# Altium project UWB_Beacon.PrjPcb
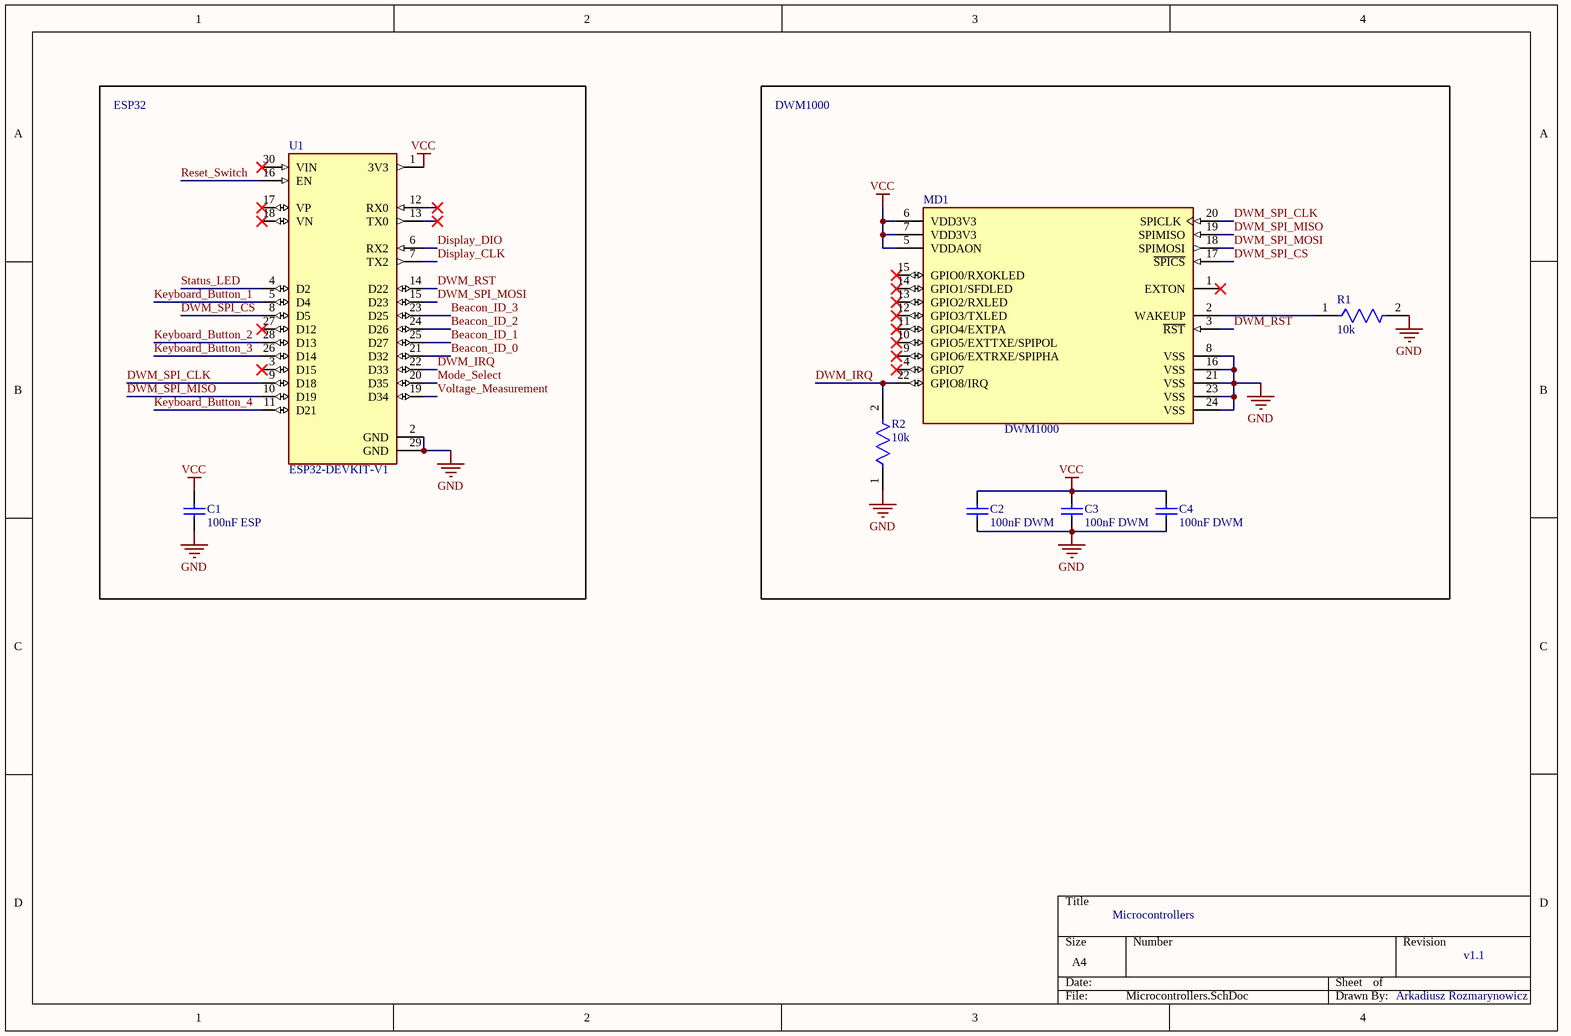
[diagram p0: Microcontrollers.SchDoc]
4 sheets, 63 parts. Net scope: global (net labels, ports and power ports of the same name join across sheets).
Board file: UWB_Beacon_PCB.PcbDoc
Sheets:
  Microcontrollers.SchDoc
  Power.SchDoc
  Connectors.SchDoc
  Interface.SchDoc

## Sheet Microcontrollers.SchDoc
size A4; SheetNumber: 1; SheetTotal: 4

### Parts
C1  100nF ESP  [CAPC2013X145X48NL20T23]
C2  100nF DWM  [CAPC2013X145X48NL20T23]
C3  100nF DWM  [CAPC2013X145X48NL20T23]
C4  100nF DWM  [CAPC2013X145X48NL20T23]
MD1  DWM1000  [FP-DWM1000-MFG]
R1  10k  [FP-CRGCQ0805-IPC_C]
R2  10k  [FP-CRGCQ0805-IPC_C]
U1  ESP32-DEVKIT-V1  [MODULE_ESP32_DEVKIT_V1]

### Blocks framed on the sheet
ESP32: C1 U1
DWM1000: C2-C4 MD1 R1 R2

### Nets
GND: C1.1 C2.1 C3.1 C4.1 MD1.8(VSS) MD1.16(VSS) MD1.21(VSS) MD1.23(VSS) MD1.24(VSS) R1.2 R2.1 U1.2(GND) U1.29(GND)
VCC: C1.2 C2.2 C3.2 C4.2 MD1.5(VDDAON) MD1.6(VDD3V3) MD1.7(VDD3V3) U1.1(3V3)
Beacon_ID_0: U1.21(D32)
Beacon_ID_1: U1.25(D27)
Beacon_ID_2: U1.24(D26)
Beacon_ID_3: U1.23(D25)
Display_CLK: U1.7(TX2)
Display_DIO: U1.6(RX2)
DWM_IRQ: MD1.22(GPIO8/IRQ) R2.2 U1.22(D33)
DWM_RST: MD1.3(~{RST}) U1.14(D22)
DWM_SPI_CLK: MD1.20(SPICLK) U1.9(D18)
DWM_SPI_CS: MD1.17(~{SPICS}) U1.8(D5)
DWM_SPI_MISO: MD1.19(SPIMISO) U1.10(D19)
DWM_SPI_MOSI: MD1.18(SPIMOSI) U1.15(D23)
Keyboard_Button_1: U1.5(D4)
Keyboard_Button_2: U1.28(D13)
Keyboard_Button_3: U1.26(D14)
Keyboard_Button_4: U1.11(D21)
Mode_Select: U1.20(D35)
Reset_Switch: U1.16(EN)
Status_LED: U1.4(D2)
Voltage_Measurement: U1.19(D34)
NetMD1_2: MD1.2(WAKEUP) R1.1

Not connected (* = marked no-connect by the designer): MD1 1(EXTON)* 4(GPIO7)* 9(GPIO6/EXTRXE/SPIPHA)* 10(GPIO5/EXTTXE/SPIPOL)* 11(GPIO4/EXTPA)* 12(GPIO3/TXLED)* 13(GPIO2/RXLED)* 14(GPIO1/SFDLED)* 15(GPIO0/RXOKLED)*; U1 3(D15)* 12(RX0)* 13(TX0)* 17(VP)* 18(VN)* 27(D12)* 30(VIN)*

### Notes on the sheet
- Microcontrollers
- v1.1
- Arkadiusz Rozmarynowicz

### Library data of the parts
C1-C4 = CMP-2007-01705-1: Part Number: VJ0805Y104KXAMR; Manufacturer: Vitramon
MD1 = CMP-231853-000001-1: RX TXRX MODULE 802.15.4 CHIP SMD
R1 R2 = CMP-03211-009742-1: CRGCQ0805 10KΩ 0.125W ±100ppm/°C 5% 150V; Manufacturer Part Number: CRGCQ0805J100K; Manufacturer: TE Connectivity; Tolerance: 0.05; Temperature Range High: +155°C; Resistance: 10k; Automotive Grade: Grade 1142; RoHS: TRUE; Package: CRGCQ0805; Octopart: https://octopart.com/crgcq0805j100k-te+connectivity-91018199; Device Class L1: Passive Components; Lead Free: Yes; Temperature: -55°C to +155°C; Category: Res; ComponentLink2Description: Datasheet; Power Rating: 0.125W; Ambient Temperature Range High: +70°C; Composition: Thick Film; Temperature Range Low: -55°C; Voltage Rating: 150V; Device Class L3: Chip SMD Resistors; Height: 0.65mm; Series: CRGCQ; Temperature Coefficient: ±100ppm/°C; Automotive: Yes; Device Class L2: Resistors; Ipc Land Pattern Name: RESC200125X55; ComponentLink2URL: https://www.te.com/commerce/DocumentDelivery/DDEController?Action=showdoc&DocId=Data+Sheet%7F1773204-3%7F1%7Fpdf%7FEnglish%7FENG_DS_1773204-3_1.pdf%7F4-2176341-1151; Value: 10k
U1 = ESP32-DEVKIT-V1: Dual core, Wi-Fi: 2.4 GHz up to 150 Mbits/s,BLE (Bluetooth Low Energy) and legacy Bluetooth, 32 bits, Up to 240 MHz; MF: Do it; SnapEDA_Link: https://www.snapeda.com/parts/ESP32-DEVKIT-V1/Do+it/view-part/?ref=snap; Package: None; Value: *; MP: ESP32-DEVKIT-V1; Check_prices: https://www.snapeda.com/parts/ESP32-DEVKIT-V1/Do+it/view-part/?ref=eda

## Sheet Power.SchDoc
size A4; SheetNumber: 2; SheetTotal: 4
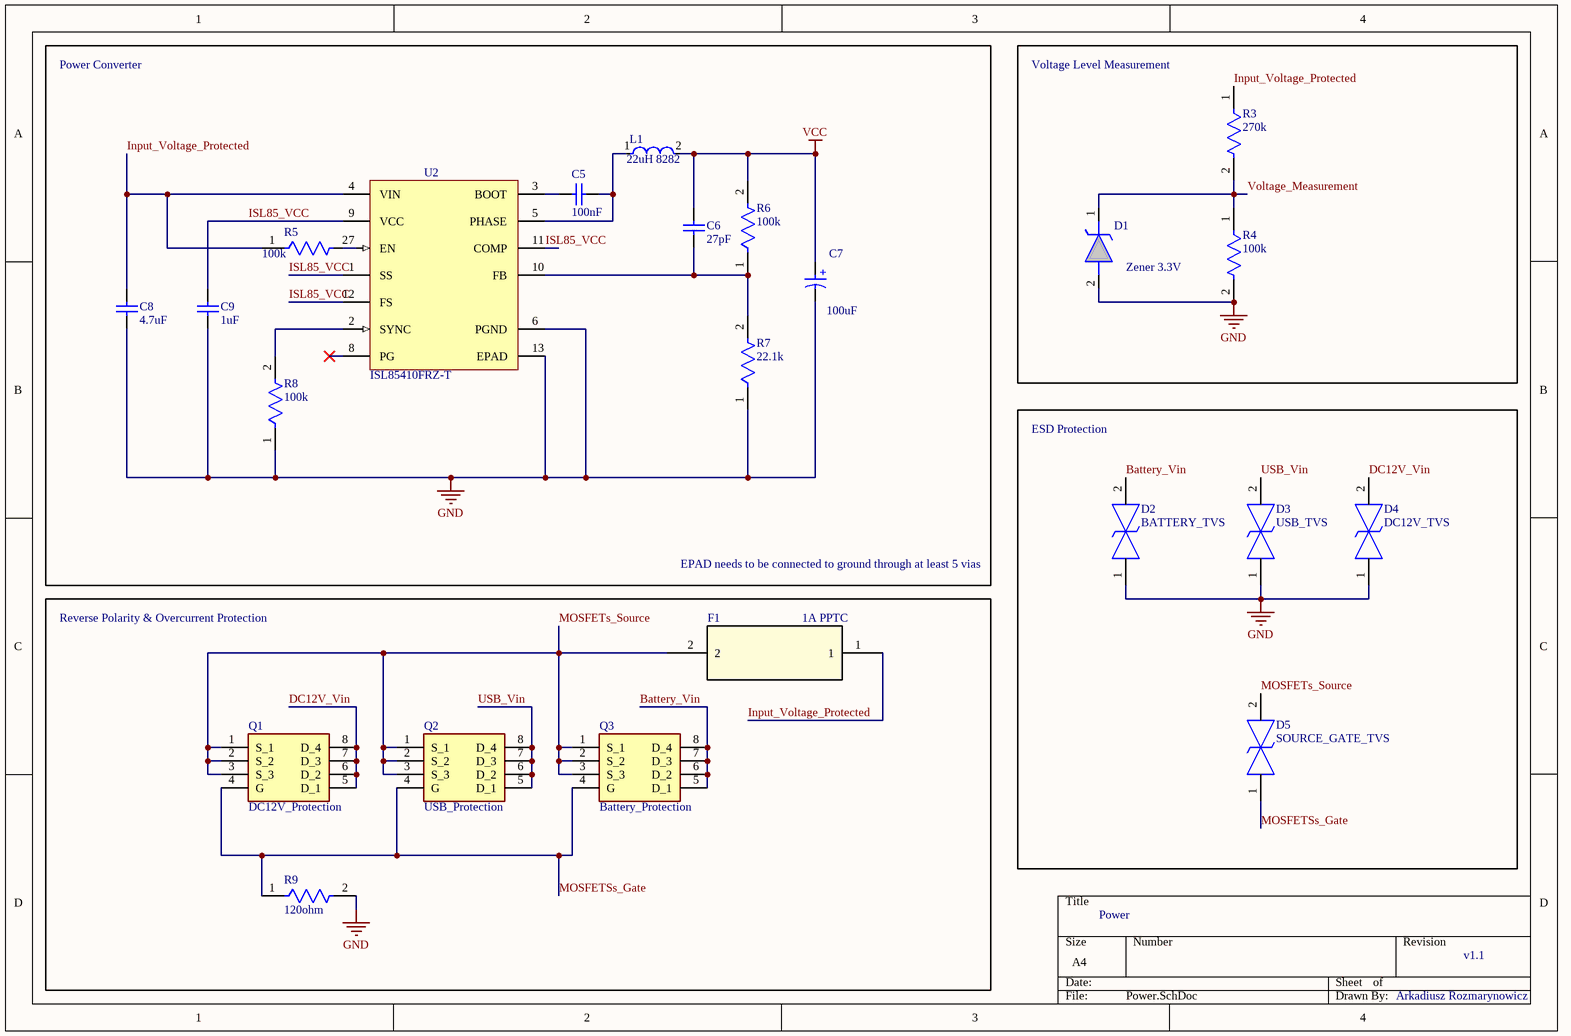
[diagram p1: Power.SchDoc]

### Parts
C5  100nF  [CAPC2013X145X48NL20T23]
C6  27pF  [CAPC2013X145X48NL20T23]
C7  100uF  [WCAP-ASLI_D6.3H7.7]
C8  4.7uF  [CAPC2013X145X48NL20T23]
C9  1uF  [CAPC2013X145X48NL20T23]
D1  Zener 3.3V  [ZMM33B]
D2  BATTERY_TVS  [DIONM5127X250N]
D3  USB_TVS  [DIONM5127X250N]
D4  DC12V_TVS  [DIONM5127X250N]
D5  SOURCE_GATE_TVS  [DIONM5127X250N]
F1  1A PPTC  [CHIP_ 0603L_1P8X1_LTF]
L1  22uH 8282  [FP-IHLP-3232DZ-FP_2_413x5-MFG]
Q1  DC12V_Protection  [SOIC127P600X170-8N]
Q2  USB_Protection  [SOIC127P600X170-8N]
Q3  Battery_Protection  [SOIC127P600X170-8N]
R3  270k  [FP-CRGCQ0805-IPC_C]
R4  100k  [FP-CRGCQ0805-IPC_C]
R5  100k  [FP-CRGCQ0805-IPC_C]
R6  100k  [FP-CRGCQ0805-IPC_C]
R7  22.1k  [FP-CRGCQ0805-IPC_C]
R8  100k  [FP-CRGCQ0805-IPC_C]
R9  120ohm  [FP-CRGCQ0805-IPC_C]
U2  ISL85410FRZ-T  [L12_4x3_MFG]

### Blocks framed on the sheet
Voltage Level Measurement: D1 R3 R4
ESD Protection: D2-D5
Reverse Polarity & Overcurrent Protection: F1 Q1-Q3 R9

### Nets
GND: C7.2(N) C8.1 C9.1 D1.2(A) D2.1 D3.1 D4.1 R4.2 R7.1 R8.1 R9.2 U2.6(PGND) U2.13(EPAD)
VCC: C6.2 C7.1(P) L1.2 R6.2
Battery_Vin: D2.2 Q3.5(D_1) Q3.6(D_2) Q3.7(D_3) Q3.8(D_4)
DC12V_Vin: D4.2 Q1.5(D_1) Q1.6(D_2) Q1.7(D_3) Q1.8(D_4)
Input_Voltage_Protected: C8.2 F1.1 R3.1 R5.1 U2.4(VIN)
ISL85_VCC: C9.2 U2.1(SS) U2.9(VCC) U2.11(COMP) U2.12(FS)
MOSFETs_Source: D5.2 F1.2 Q1.1(S_1) Q1.2(S_2) Q1.3(S_3) Q2.1(S_1) Q2.2(S_2) Q2.3(S_3) Q3.1(S_1) Q3.2(S_2) Q3.3(S_3)
MOSFETSs_Gate: D5.1 Q1.4(G) Q2.4(G) Q3.4(G) R9.1
USB_Vin: D3.2 Q2.5(D_1) Q2.6(D_2) Q2.7(D_3) Q2.8(D_4)
Voltage_Measurement: D1.1(K) R3.2 R4.1
NetC5_1: C5.1 L1.1 U2.5(PHASE)
NetC5_2: C5.2 U2.3(BOOT)
NetC6_1: C6.1 R6.1 R7.2 U2.10(FB)
NetR5_2: R5.2 U2.7(EN)
NetR8_2: R8.2 U2.2(SYNC)

Not connected (* = marked no-connect by the designer): U2 8(PG)*

### Notes on the sheet
- Power Converter
- EPAD needs to be connected to ground through at least 5 vias
- Power
- v1.1
- Arkadiusz Rozmarynowicz
- (in symbol CMP-03913-54202496-2) +

### Library data of the parts
C5 C6 C8 C9 = CMP-2007-01705-1: as C1 on sheet Microcontrollers
C7 = CMP-03913-54202496-2: Cap Aluminum Lytic 100uF 35V 20% (6.3 X 7.7mm) SMD 300mA 2000h 105C T/R; Capacitance: 100µF; Impedance: 380mΩ; Insulation Resistance: 1MΩ; ESR (Equivalent Series Resistance): 321.392mΩ; Dissipation Factor: 14%; Leakage Current: 35µA; Life (Hours): 2000hours; Min Operating Temperature: -55°C; Height: 7.7mm; Tolerance: 20%; Ripple Current (AC): 300mA; Length: 7.7mm; Width: 6.6mm; Voltage Rating: 35V; REACH SVHC: Unknown; Ripple Current: 300mA; Diameter: 6.3mm; Max Operating Temperature: 105°C; RoHS: Compliant; Voltage Rating (DC): 35V; Packaging: Cut Tape; Case/Package: Radial
D1 = ZMM33B: SMD Planra Zener Diode; Manufacturer_Name: Diotec; Geometry.Height: 1.45mm; Manufacturer_Part_Number: ZMM33B; Mouser Part Number: 637-ZMM33B; Mouser Price/Stock: https://www.mouser.co.uk/ProductDetail/Diotec-Semiconductor/ZMM33B?qs=OlC7AqGiEDlS5hTI7j6ASg%3D%3D; Arrow Part Number: ZMM33B; Arrow Price/Stock: https://www.arrow.com/en/products/zmm33b/diotec-semiconductor-ag?utm_currency=USD&region=nac; Datasheet Link: *
D2-D5 = SMAJ12CA-HP6AT_13: 19.9V Clamp 30.2A Ipp Tvs Diode Surface Mount DO-214AC (SMA); Manufacturer_Name: YAGEO; Manufacturer_Part_Number: SMAJ12CA-HP6AT/13; Geometry.Height: 2.5mm; Mouser Part Number: *; Mouser Price/Stock: *; Arrow Part Number: *; Arrow Price/Stock: *; Datasheet Link: https://www.yageo.com/upload/media/product/productsearch/datasheet/cpc/tvs/SMAJ-HP6AT_1.pdf
F1 = 0603L100SLYR: PPTC; Manufacturer_Name: Littelfuse Inc; Copyright: Copyright (C) 2025 Ultra Librarian. All rights reserved.; Manufacturer_Part_Number: 0603L100SLYR; RefDes: RefDes; Type: Type
L1 = CMP-02424-000385-1: Commercial Inductors, High Temperature (155 °C) Series 22uH 3.7A 110.21mΩ 20%; Max DC Current: 3.8A; DC Resistance (DCR): 110.21mR; Self Resonant Frequency: 9MHz; Test Frequency: 100kHz; Shielding: Shielded; Length: 0.322inch; Inductance: 22uH; Package Quantity: 500; Military Standard: Not; Min Operating Temperature: -55°C; Lead Free: Lead Free; Packaging: Tape and Reel; Current Rating: 3.7A; Depth: 8.26mm; Height: 4mm; Max Operating Temperature: 155°C; Width: 0.322inch; Tolerance: 20%; Case/Package: 3232; Saturation Current: 3.8A; Height - Seated (Max): 0.158inch; Mount: Surface Mount; Termination: SMD/SMT
Q1-Q3 = DMP3056LSS-13: MOSFET P Channel 30V 7.1A 2.1V @ 250uA 45m @ 6A,10V SOP-8_150mil RoHS; Manufacturer_Name: Diodes Incorporated; Geometry.Height: 1.7mm; Manufacturer_Part_Number: DMP3056LSS-13; Mouser Part Number: 621-DMP3056LSS-13; Mouser Price/Stock: https://www.mouser.co.uk/ProductDetail/Diodes-Incorporated/DMP3056LSS-13?qs=oUsD4qhOtFyEnPLZKitYRA%3D%3D; Arrow Part Number: DMP3056LSS-13; Arrow Price/Stock: https://www.arrow.com/en/products/dmp3056lss-13/diodes-incorporated?region=asia; Datasheet Link: https://www.diodes.com//assets/Datasheets/ds31421.pdf
R3 R4 R9 = CMP-03211-009742-1: CRGCQ0805 10KΩ 0.125W ±100ppm/°C 5% 150V; Manufacturer Part Number: CRGCQ0805J100K; Manufacturer: TE Connectivity; Resistance: 100ohm; Tolerance: 0.05; Value: 100ohm; Temperature Range High: +155°C; Automotive Grade: Grade 1142; RoHS: TRUE; Package: CRGCQ0805; Octopart: https://octopart.com/crgcq0805j100k-te+connectivity-91018199; Device Class L1: Passive Components; Lead Free: Yes; Temperature: -55°C to +155°C; Category: Res; ComponentLink2Description: Datasheet; Power Rating: 0.125W; Ambient Temperature Range High: +70°C; Composition: Thick Film; Temperature Range Low: -55°C; Voltage Rating: 150V; Device Class L3: Chip SMD Resistors; Height: 0.65mm; Series: CRGCQ; Temperature Coefficient: ±100ppm/°C; Automotive: Yes; Device Class L2: Resistors; Ipc Land Pattern Name: RESC200125X55; ComponentLink2URL: https://www.te.com/commerce/DocumentDelivery/DDEController?Action=showdoc&DocId=Data+Sheet%7F1773204-3%7F1%7Fpdf%7FEnglish%7FENG_DS_1773204-3_1.pdf%7F4-2176341-1151
R5-R8 = CMP-03211-009742-1: CRGCQ0805 100KΩ 0.125W ±100ppm/°C 5% 150V; Manufacturer Part Number: CRGCQ0805J100K; Manufacturer: TE Connectivity; Tolerance: 0.05; Temperature Range High: +155°C; Automotive Grade: Grade 1142; RoHS: TRUE; Package: CRGCQ0805; Octopart: https://octopart.com/crgcq0805j100k-te+connectivity-91018199; Device Class L1: Passive Components; Lead Free: Yes; Temperature: -55°C to +155°C; Category: Res; ComponentLink2Description: Datasheet; Power Rating: 0.125W; Ambient Temperature Range High: +70°C; Composition: Thick Film; Temperature Range Low: -55°C; Voltage Rating: 150V; Device Class L3: Chip SMD Resistors; Height: 0.65mm; Series: CRGCQ; Temperature Coefficient: ±100ppm/°C; Automotive: Yes; Device Class L2: Resistors; Ipc Land Pattern Name: RESC200125X55; ComponentLink2URL: https://www.te.com/commerce/DocumentDelivery/DDEController?Action=showdoc&DocId=Data+Sheet%7F1773204-3%7F1%7Fpdf%7FEnglish%7FENG_DS_1773204-3_1.pdf%7F4-2176341-1151
  R5 R6 R8: Resistance: 100KΩ; Value: 100KΩ
  R7: Resistance: 22.1k; Value: 22.1k
U2 = CMP-00572-88255842-3: Inverter RoHS Compliant Adjustable Positive Switching Regulator IC 125C 2MHz 1A 82.298666mg; Manufacturer Lifecycle Status: ACTIVE; Efficiency: 94%; RAM Size: 12kB; Max Supply Voltage: 40V; Topology: Buck; Min Output Voltage: 600mV; Max Junction Temperature (Tj): 125°C; Min Supply Voltage: 3V; Pitch: 500µm; Operating Supply Current: 4µA; Sync/Async: Synchronous; Max Output Voltage: 34V; Number of Outputs: 1; Synchronous Rectifier: Yes; Operating Supply Voltage: 36V; Quiescent Current: 80µA; HelpURL: https://octopart.com/cad-content/api/get-model-datasheet/15189/88255842; ComponentLink1URL: http://www.renesas.com; Switching Frequency: 2MHz; ComponentLink3URL: https://www.renesas.com/en/document/psc/l124x3-12-lead-dual-flat-no-lead-plastic-package?r=568491; Max Operating Temperature: 125°C; Export Control Classification Number (ECCN) Code: EAR99; Lead Free: Lead Free; ComponentLink2Description: Datasheet URL; Length: 4mm; Min Operating Temperature: -40°C; ComponentLink2URL: https://octopart.com/cad-content/api/get-model-datasheet/15189/88255842; ComponentLink1Description: Manufacturer's Website; Width: 3mm; Output Type: Adjustable; Max Output Current: 1A; Packaging: Tape & Reel; Case/Package: DFN; Mount: Surface Mount; Number of Pins: 12; Weight: 82.298666mg; Min Input Voltage: 3V; ComponentLink3Description: Manufacturer's Package Drawing; Max Input Voltage: 40V; Logic Function: Inverter; RoHS: Compliant; Output Current: 1A; Output Configuration: Positive; Lifecycle Status: Production; Height: 900µm; Output Voltage: 34V; Radiation Hardening: No

## Sheet Connectors.SchDoc
size A4; SheetNumber: 3; SheetTotal: 4
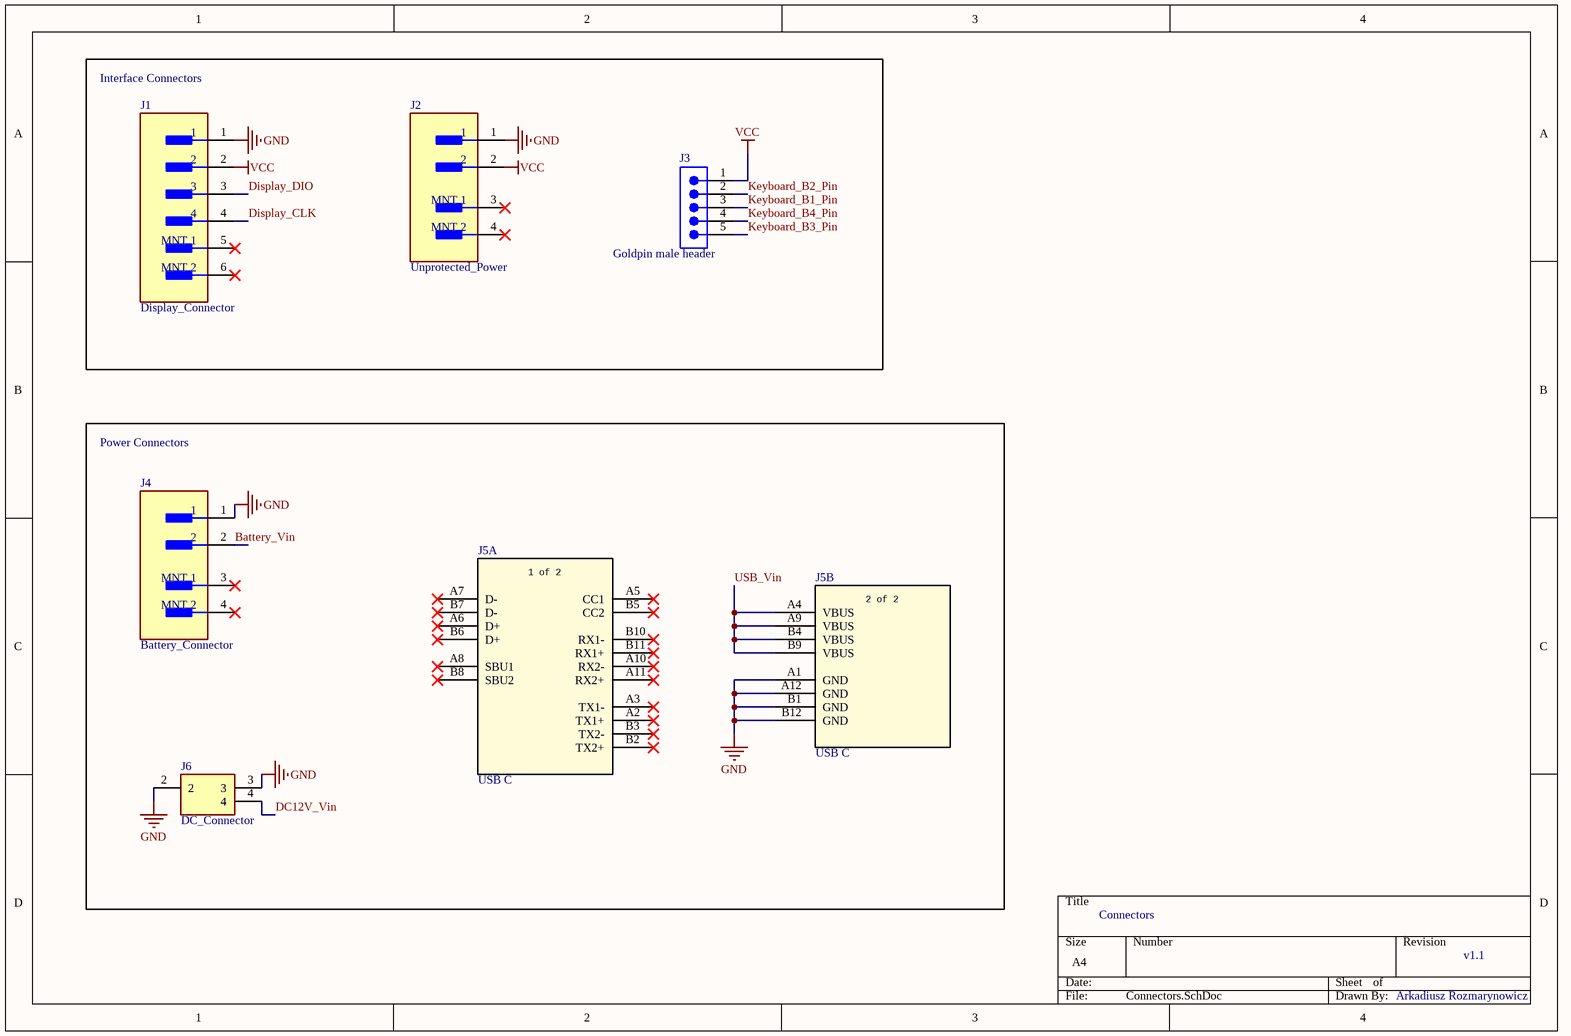
[diagram p2: Connectors.SchDoc]

### Parts
J1  Display_Connector  [FP-BM04B-GHS-TBT_LF_SN-MFG]
J2  Unprotected_Power  [FP-SM02B-GHS-TB_LF_SN-MFG]
J3  Goldpin male header  [SMTC-MTLW-105-05-X-S-190]
J4  Battery_Connector  [FP-SM02B-GHS-TB_LF_SN-MFG]
J5  USB C  [CONN_1054500101_MOL]  (parts A,B of 2)
J6  DC_Connector  [PCGK21]

### Blocks framed on the sheet
Interface Connectors: J1-J3
Power Connectors: J4-J6

### Nets
GND: J1.1 J2.1 J4.1 J5.A1(GND) J5.A12(GND) J5.B1(GND) J5.B12(GND) J6.2 J6.3
VCC: J1.2 J2.2 J3.1
Battery_Vin: J4.2
DC12V_Vin: J6.4
Display_CLK: J1.4
Display_DIO: J1.3
Keyboard_B1_Pin: J3.3
Keyboard_B2_Pin: J3.2
Keyboard_B3_Pin: J3.5
Keyboard_B4_Pin: J3.4
USB_Vin: J5.A4(VBUS) J5.A9(VBUS) J5.B4(VBUS) J5.B9(VBUS)

Not connected (* = marked no-connect by the designer): J1 5(MNT_1)* 6(MNT_2)*; J2 3(MNT_1)* 4(MNT_2)*; J4 3(MNT_1)* 4(MNT_2)*; J5 A2(TX1+)* A3(TX1-)* A5(CC1)* A6(D+)* A7(D-)* A8(SBU1)* A10(RX2-)* A11(RX2+)* B2(TX2+)* B3(TX2-)* B5(CC2)* B6(D+)* B7(D-)* B8(SBU2)* B10(RX1-)* B11(RX1+)*

### Notes on the sheet
- Connectors
- v1.1
- Arkadiusz Rozmarynowicz
- (in symbol 1054500101, part A) 1 of 2
- (in symbol 1054500101, part B) 2 of 2

### Library data of the parts
J1 = CMP-17439-000062-2: CONN HEADER SMD 4POS 1.25MM; Number of Positions: 4; Wire/Cable Gauge: 26AWG; Current Rating: 1A; Voltage Rating (AC): 50V; Gender: Male; Orientation: Straight; Max Operating Temperature: 85°C; Pitch: 1.25mm; Contact Plating: Tin; Number of Rows: 4; Series: GH; Min Operating Temperature: -25°C; REACH SVHC: No SVHC; Packaging: Cut Tape; Lead Free: Lead Free; Voltage Rating: 50V; Contact Material: Bronze; Number of Contacts: 4; Termination: Crimp; Case/Package: SMD/SMT; Housing Color: Natural; Housing Material: Nylon
J2 J4 = CMP-2000-07076-2: CONN HEADER SMD R/A 2POS 1.25MM; Voltage Rating: 50V; Number of Positions: 2; Pitch: 0.049inch; Current Rating: 1A; Connector Type: Outer Shroud Contact; Number of Rows: 1; Contact Material: Bronze; Termination: Solder; Color: Natural; Package Quantity: 2500; Mount: Surface Mount; Housing Color: Natural; Number of Contacts: 2; Packaging: Tape and Reel; Lead Free: Lead Free; Housing Material: Nylon; Orientation: Right Angle; Contact Type: Male Pin; Contact Plating: Tin; Series: GH; Fastening Type: Latch
J3 = CMP-1024-00077-1: Low Profile .025" SQ Post Header, Through-hole, Vertical, -55 to 105 degC, 2.54 mm Pitch, 5-Pin, Male, RoHS; Manufacturer: Samtec; PartNumber: MTLW-105-05-T-S-190; Pitch: 2.54 mm; RoHS: True; Temperature Range: -55 to 105 degC; Orientation: Vertical; ComponentLink1Description: Manufacturer URL; DatasheetVersion: F-214; ComponentLink3URL: http://www.samtec.com/documents/webfiles/cpdf/MTLW-1XX-XX-XX-X-XXX-XX-XX-MKT1.pdf; ComponentLink2URL: http://www.samtec.com/documents/webfiles/pdf/MTLW_TH.PDF; Mounting Technology: Through-hole; ComponentLink1URL: http://www.samtec.com; ComponentLink2Description: Datasheet; ComponentLink3Description: Package Specification; PackageVersion: T, 6/1991; PackageReference: MTLW-105-05-X-S-190; PackageDescription: Low Profile Terminal Assembly
J5 = 1054500101: Universal Serial Bus (USB) Shielded I/O Receptacle, Type C, Right-Angle, Top Mount, Surface Mount, 0.80mm Solder Tabs, Gold (Au) Flash over 0.76Âµm Palladium Nickel Plating; Manufacturer_Name: Molex; Copyright: Copyright (C) 2026 Ultra Librarian. All rights reserved.; Manufacturer_Part_Number: 1054500101; RefDes: RefDes; Type: Type
J6 = PC-GK2.1: Socket; DC supply; male; 5.5/2.1mm; 5.5mm; 2.1mm; THT; angled 90; Manufacturer_Name: Ninigi; Geometry.Height: 11.2mm; Manufacturer_Part_Number: PC-GK2.1; Mouser Part Number: *; Mouser Price/Stock: *; Arrow Part Number: *; Arrow Price/Stock: *; Datasheet Link: https://www.tme.eu/Document/78afd4fb8a41e4211137cd818ea9e93d/PC-GK21.jpg

## Sheet Interface.SchDoc
size A4; SheetNumber: 4; SheetTotal: 4
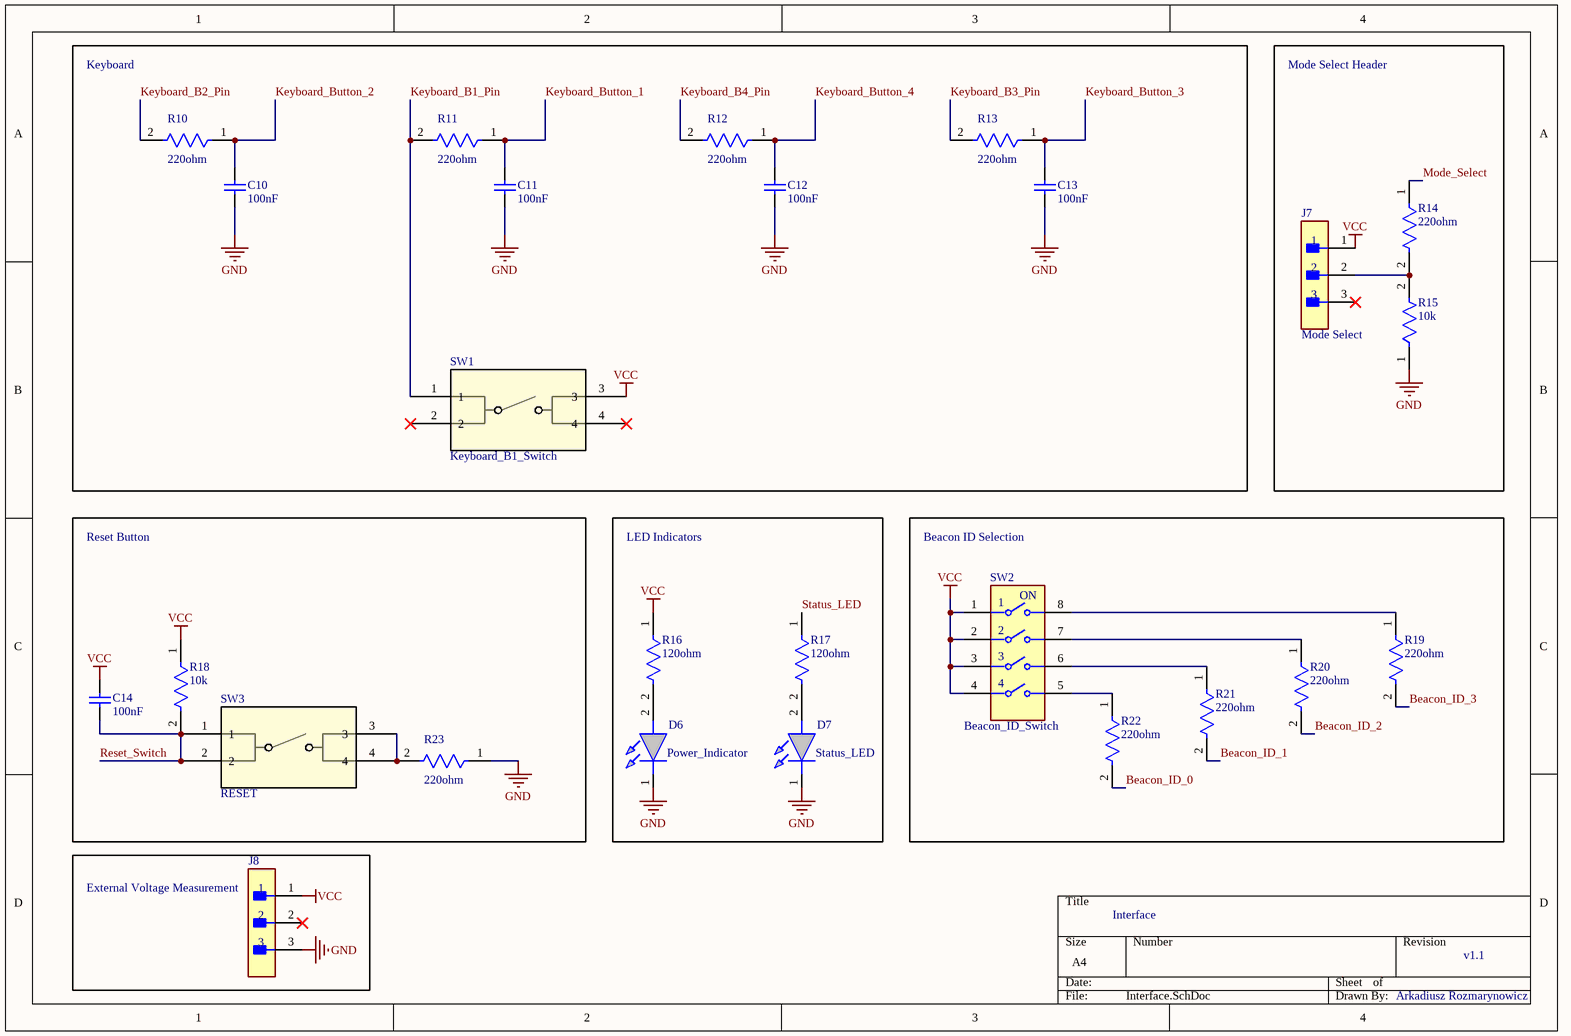
[diagram p3: Interface.SchDoc]

### Parts
C10  100nF  [CAPC2013X145X48NL20T23]
C11  100nF  [CAPC2013X145X48NL20T23]
C12  100nF  [CAPC2013X145X48NL20T23]
C13  100nF  [CAPC2013X145X48NL20T23]
C14  100nF  [CAPC2013X145X48NL20T23]
D6  Power_Indicator  [LEDC2012X40N]
D7  Status_LED  [LEDC2012X40N]
J7  Mode Select  [FP-TMM-103-03-T-S-MFG]
J8  External Voltage Measurement  [FP-TMM-103-03-T-S-MFG]
R10  220ohm  [FP-CRGCQ0805-IPC_C]
R11  220ohm  [FP-CRGCQ0805-IPC_C]
R12  220ohm  [FP-CRGCQ0805-IPC_C]
R13  220ohm  [FP-CRGCQ0805-IPC_C]
R14  220ohm  [FP-CRGCQ0805-IPC_C]
R15  10k  [FP-CRGCQ0805-IPC_C]
R16  120ohm  [FP-CRGCQ0805-IPC_C]
R17  120ohm  [FP-CRGCQ0805-IPC_C]
R18  10k  [FP-CRGCQ0805-IPC_C]
R19  220ohm  [FP-CRGCQ0805-IPC_C]
R20  220ohm  [FP-CRGCQ0805-IPC_C]
R21  220ohm  [FP-CRGCQ0805-IPC_C]
R22  220ohm  [FP-CRGCQ0805-IPC_C]
R23  220ohm  [FP-CRGCQ0805-IPC_C]
SW1  Keyboard_B1_Switch  [SW4_FSM-5P23_TEC]
SW2  Beacon_ID_Switch  [FP-A6S-4104-H-MFG]
SW3  RESET  [SW4_FSM-5P23_TEC]

### Blocks framed on the sheet
Keyboard: C10-C13 R10-R13 SW1
Mode Select Header: J7 R14 R15
LED Indicators: D6 D7 R16 R17
Beacon ID Selection: R19-R22 SW2

### Nets
GND: C10.1 C11.1 C12.1 C13.1 D6.1(K) D7.1(K) J8.3 R15.1 R23.1
VCC: C14.2 J7.1 J8.1 R16.1 R18.1 SW1.3 SW2.1 SW2.2 SW2.3 SW2.4
Beacon_ID_0: R22.2
Beacon_ID_1: R21.2
Beacon_ID_2: R20.2
Beacon_ID_3: R19.2
Keyboard_B1_Pin: R11.2 SW1.1
Keyboard_B2_Pin: R10.2
Keyboard_B3_Pin: R13.2
Keyboard_B4_Pin: R12.2
Keyboard_Button_1: C11.2 R11.1
Keyboard_Button_2: C10.2 R10.1
Keyboard_Button_3: C13.2 R13.1
Keyboard_Button_4: C12.2 R12.1
Mode_Select: R14.1
Reset_Switch: C14.1 R18.2 SW3.1 SW3.2
Status_LED: R17.1
NetD6_2: D6.2(A) R16.2
NetD7_2: D7.2(A) R17.2
NetJ7_2: J7.2 R14.2 R15.2
NetR19_1: R19.1 SW2.8
NetR20_1: R20.1 SW2.7
NetR21_1: R21.1 SW2.6
NetR22_1: R22.1 SW2.5
NetR23_2: R23.2 SW3.3 SW3.4

Not connected (* = marked no-connect by the designer): J7 3*; J8 2*; SW1 2* 4*

### Notes on the sheet
- Reset Button
- Interface
- v1.1
- Arkadiusz Rozmarynowicz
- (in symbol CMP-08827-000006-1) ON

### Library data of the parts
C10-C14 = CMP-2007-01705-1: as C1 on sheet Microcontrollers
D6 D7 = LS_R976: Red 0805 CHIPLED LS R976N-R102 Osram Opto LS R976, CHIPLED 0805 Series Red LED, 633 nm, 2012 (0805), Rectangle Lens SMD Package; Manufacturer_Name: ams OSRAM; Manufacturer_Part_Number: LS R976; Geometry.Height: 0.4mm; Mouser Part Number: 720-LSR976D5178; Mouser Price/Stock: https://www.mouser.co.uk/ProductDetail/OSRAM-Opto-Semiconductors/LS-R976?qs=OIr7YF%252B2cWVTfzKl425Fkw%3D%3D; Arrow Part Number: LS R976; Arrow Price/Stock: https://www.arrow.com/en/products/lsr976/osram-opto-semiconductors?region=europe; Datasheet Link: http://uk.rs-online.com/web/p/products/4974804
J7 J8 = CMP-02766-001695-1: CONN HEADER VERT 3POS 2MM; Gender: Male; Number of Positions: 3; Max Current Rating: 3.9A; Max Voltage Rating (AC): 500V; Packaging: Bulk; RoHS Compliant: Yes; Mount: Through Hole; Length: 6mm; Contact Type: Male Pin; Package Quantity: 1; Depth: 1.97mm; Contact Material: Bronze; Insulation Material: Polymer; Series: TMM; Contact Plating: Tin; Fastening Type: Pull; Housing Color: Black; Pitch: 2mm; Termination: Solder; Contact Mating Length: 0.157inch; Min Operating Temperature: -55°C; REACH SVHC: No SVHC; Orientation: Straight; Number of Rows: 1; Color: Black; Insulation Color: Black; Connector Type: Header; Radiation Hardening: No; Number of Contacts: 3; Lead Free: Lead Free; Contact Finish - Mating: TIN; Max Operating Temperature: 105°C; Housing Material: Polymer; Contact Shape: Square
R10-R13 R23 = CMP-03211-009742-1: CRGCQ0805 100KΩ 0.125W ±100ppm/°C 5% 150V; Manufacturer Part Number: CRGCQ0805J100K; Manufacturer: TE Connectivity; Resistance: 1k; Tolerance: 0.05; Temperature Range High: +155°C; Automotive Grade: Grade 1142; RoHS: TRUE; Package: CRGCQ0805; Octopart: https://octopart.com/crgcq0805j100k-te+connectivity-91018199; Device Class L1: Passive Components; Lead Free: Yes; Temperature: -55°C to +155°C; Category: Res; ComponentLink2Description: Datasheet; Power Rating: 0.125W; Ambient Temperature Range High: +70°C; Composition: Thick Film; Temperature Range Low: -55°C; Voltage Rating: 150V; Device Class L3: Chip SMD Resistors; Height: 0.65mm; Series: CRGCQ; Temperature Coefficient: ±100ppm/°C; Automotive: Yes; Device Class L2: Resistors; Ipc Land Pattern Name: RESC200125X55; ComponentLink2URL: https://www.te.com/commerce/DocumentDelivery/DDEController?Action=showdoc&DocId=Data+Sheet%7F1773204-3%7F1%7Fpdf%7FEnglish%7FENG_DS_1773204-3_1.pdf%7F4-2176341-1151; Value: 220ohm
R14 R19-R22 = CMP-03211-009742-1: CRGCQ0805 10KΩ 0.125W ±100ppm/°C 5% 150V; Manufacturer Part Number: CRGCQ0805J100K; Manufacturer: TE Connectivity; Resistance: 10k; Tolerance: 0.05; Temperature Range High: +155°C; Automotive Grade: Grade 1142; RoHS: TRUE; Package: CRGCQ0805; Octopart: https://octopart.com/crgcq0805j100k-te+connectivity-91018199; Device Class L1: Passive Components; Lead Free: Yes; Temperature: -55°C to +155°C; Category: Res; ComponentLink2Description: Datasheet; Power Rating: 0.125W; Ambient Temperature Range High: +70°C; Composition: Thick Film; Temperature Range Low: -55°C; Voltage Rating: 150V; Device Class L3: Chip SMD Resistors; Height: 0.65mm; Series: CRGCQ; Temperature Coefficient: ±100ppm/°C; Automotive: Yes; Device Class L2: Resistors; Ipc Land Pattern Name: RESC200125X55; ComponentLink2URL: https://www.te.com/commerce/DocumentDelivery/DDEController?Action=showdoc&DocId=Data+Sheet%7F1773204-3%7F1%7Fpdf%7FEnglish%7FENG_DS_1773204-3_1.pdf%7F4-2176341-1151; Value: 220ohm
R15 R18 = CMP-03211-009742-1: as R1 on sheet Microcontrollers; Temperature Range High: +155°C; Resistance: 10k; Automotive Grade: Grade 1142; RoHS: TRUE; Package: CRGCQ0805; Octopart: https://octopart.com/crgcq0805j100k-te+connectivity-91018199; Device Class L1: Passive Components; Lead Free: Yes; Temperature: -55°C to +155°C; Category: Res; ComponentLink2Description: Datasheet; Power Rating: 0.125W; Ambient Temperature Range High: +70°C; Composition: Thick Film; Temperature Range Low: -55°C; Voltage Rating: 150V; Device Class L3: Chip SMD Resistors; Height: 0.65mm; Series: CRGCQ; Temperature Coefficient: ±100ppm/°C; Automotive: Yes; Device Class L2: Resistors; Ipc Land Pattern Name: RESC200125X55; ComponentLink2URL: https://www.te.com/commerce/DocumentDelivery/DDEController?Action=showdoc&DocId=Data+Sheet%7F1773204-3%7F1%7Fpdf%7FEnglish%7FENG_DS_1773204-3_1.pdf%7F4-2176341-1151; Value: 10k
R16 R17 = CMP-03211-009742-1: CRGCQ0805 100KΩ 0.125W ±100ppm/°C 5% 150V; Manufacturer Part Number: CRGCQ0805J100K; Manufacturer: TE Connectivity; Resistance: 120; Tolerance: 0.05; Value: 120; Temperature Range High: +155°C; Automotive Grade: Grade 1142; RoHS: TRUE; Package: CRGCQ0805; Octopart: https://octopart.com/crgcq0805j100k-te+connectivity-91018199; Device Class L1: Passive Components; Lead Free: Yes; Temperature: -55°C to +155°C; Category: Res; ComponentLink2Description: Datasheet; Power Rating: 0.125W; Ambient Temperature Range High: +70°C; Composition: Thick Film; Temperature Range Low: -55°C; Voltage Rating: 150V; Device Class L3: Chip SMD Resistors; Height: 0.65mm; Series: CRGCQ; Temperature Coefficient: ±100ppm/°C; Automotive: Yes; Device Class L2: Resistors; Ipc Land Pattern Name: RESC200125X55; ComponentLink2URL: https://www.te.com/commerce/DocumentDelivery/DDEController?Action=showdoc&DocId=Data+Sheet%7F1773204-3%7F1%7Fpdf%7FEnglish%7FENG_DS_1773204-3_1.pdf%7F4-2176341-1151
SW1 SW3 = 1571563-4: FSM4JSMAATR=TACTSWITCH,SMT,T&R; Manufacturer_Name: TE Connectivity; Copyright: Copyright (C) 2025 Ultra Librarian. All rights reserved.; Manufacturer_Part_Number: 1571563-4; RefDes: RefDes; Type: Type
SW2 = CMP-08827-000006-1: SWITCH SLIDE DIP SPST 25MA 24V; Manufacturer Part Number: A6S-4104-H; Manufacturer: Omron Electronics Inc-EMC Div; Number Of Circuits: 4; Electromechanical Life: 1000Cycles; Contact Resistance: 200mΩ; Standoff Height: 0.7mm; Device Class L3: DIP Switches; Throw Configuration: SPST; Mouser Description: DIP Switches / SIP Switches Dip Switch; Device Class L2: Switches; Ambient Temperature Range Low: -20°C; Temperature: -20°C to +70°C; Digikey Description: SWITCH SLIDE DIP SPST 25MA 24V; Temperature Range Low: -20°C; Octopart: https://octopart.com/a6s-4104-h-omron-1480027; Package: 0; Device Class L1: Electromechanical; ComponentLink2URL: https://omronfs.omron.com/en_US/ecb/products/pdf/en-a6s.pdf; Temperature Range High: +70°C; Mount: Surface Mount; Voltage Rating Dc: 24V; Automotive: No; RoHS: TRUE; Category: Switch; ComponentLink2Description: Datasheet; Lead Free: Yes; Height: 4.5mm; Ambient Temperature Range High: +70°C; Contact Current Rating: 25mA

## Nets that join several sheets
GND: Microcontrollers (13 pins), Power (13 pins), Connectors (9 pins), Interface (9 pins)
VCC: Microcontrollers (8 pins), Power (C6.2 C7.1 L1.2 R6.2), Connectors (J1.2 J2.2 J3.1), Interface (10 pins)
Battery_Vin: Power (5 pins), Connectors (J4.2)
Beacon_ID_0: Microcontrollers (U1.21), Interface (R22.2)
Beacon_ID_1: Microcontrollers (U1.25), Interface (R21.2)
Beacon_ID_2: Microcontrollers (U1.24), Interface (R20.2)
Beacon_ID_3: Microcontrollers (U1.23), Interface (R19.2)
DC12V_Vin: Power (5 pins), Connectors (J6.4)
Display_CLK: Microcontrollers (U1.7), Connectors (J1.4)
Display_DIO: Microcontrollers (U1.6), Connectors (J1.3)
Keyboard_B1_Pin: Connectors (J3.3), Interface (R11.2 SW1.1)
Keyboard_B2_Pin: Connectors (J3.2), Interface (R10.2)
Keyboard_B3_Pin: Connectors (J3.5), Interface (R13.2)
Keyboard_B4_Pin: Connectors (J3.4), Interface (R12.2)
Keyboard_Button_1: Microcontrollers (U1.5), Interface (C11.2 R11.1)
Keyboard_Button_2: Microcontrollers (U1.28), Interface (C10.2 R10.1)
Keyboard_Button_3: Microcontrollers (U1.26), Interface (C13.2 R13.1)
Keyboard_Button_4: Microcontrollers (U1.11), Interface (C12.2 R12.1)
Mode_Select: Microcontrollers (U1.20), Interface (R14.1)
Reset_Switch: Microcontrollers (U1.16), Interface (C14.1 R18.2 SW3.1 SW3.2)
Status_LED: Microcontrollers (U1.4), Interface (R17.1)
USB_Vin: Power (5 pins), Connectors (J5.A4 J5.A9 J5.B4 J5.B9)
Voltage_Measurement: Microcontrollers (U1.19), Power (D1.1 R3.2 R4.1)